# EAGLE design motores_03 (EAGLE 6.1)
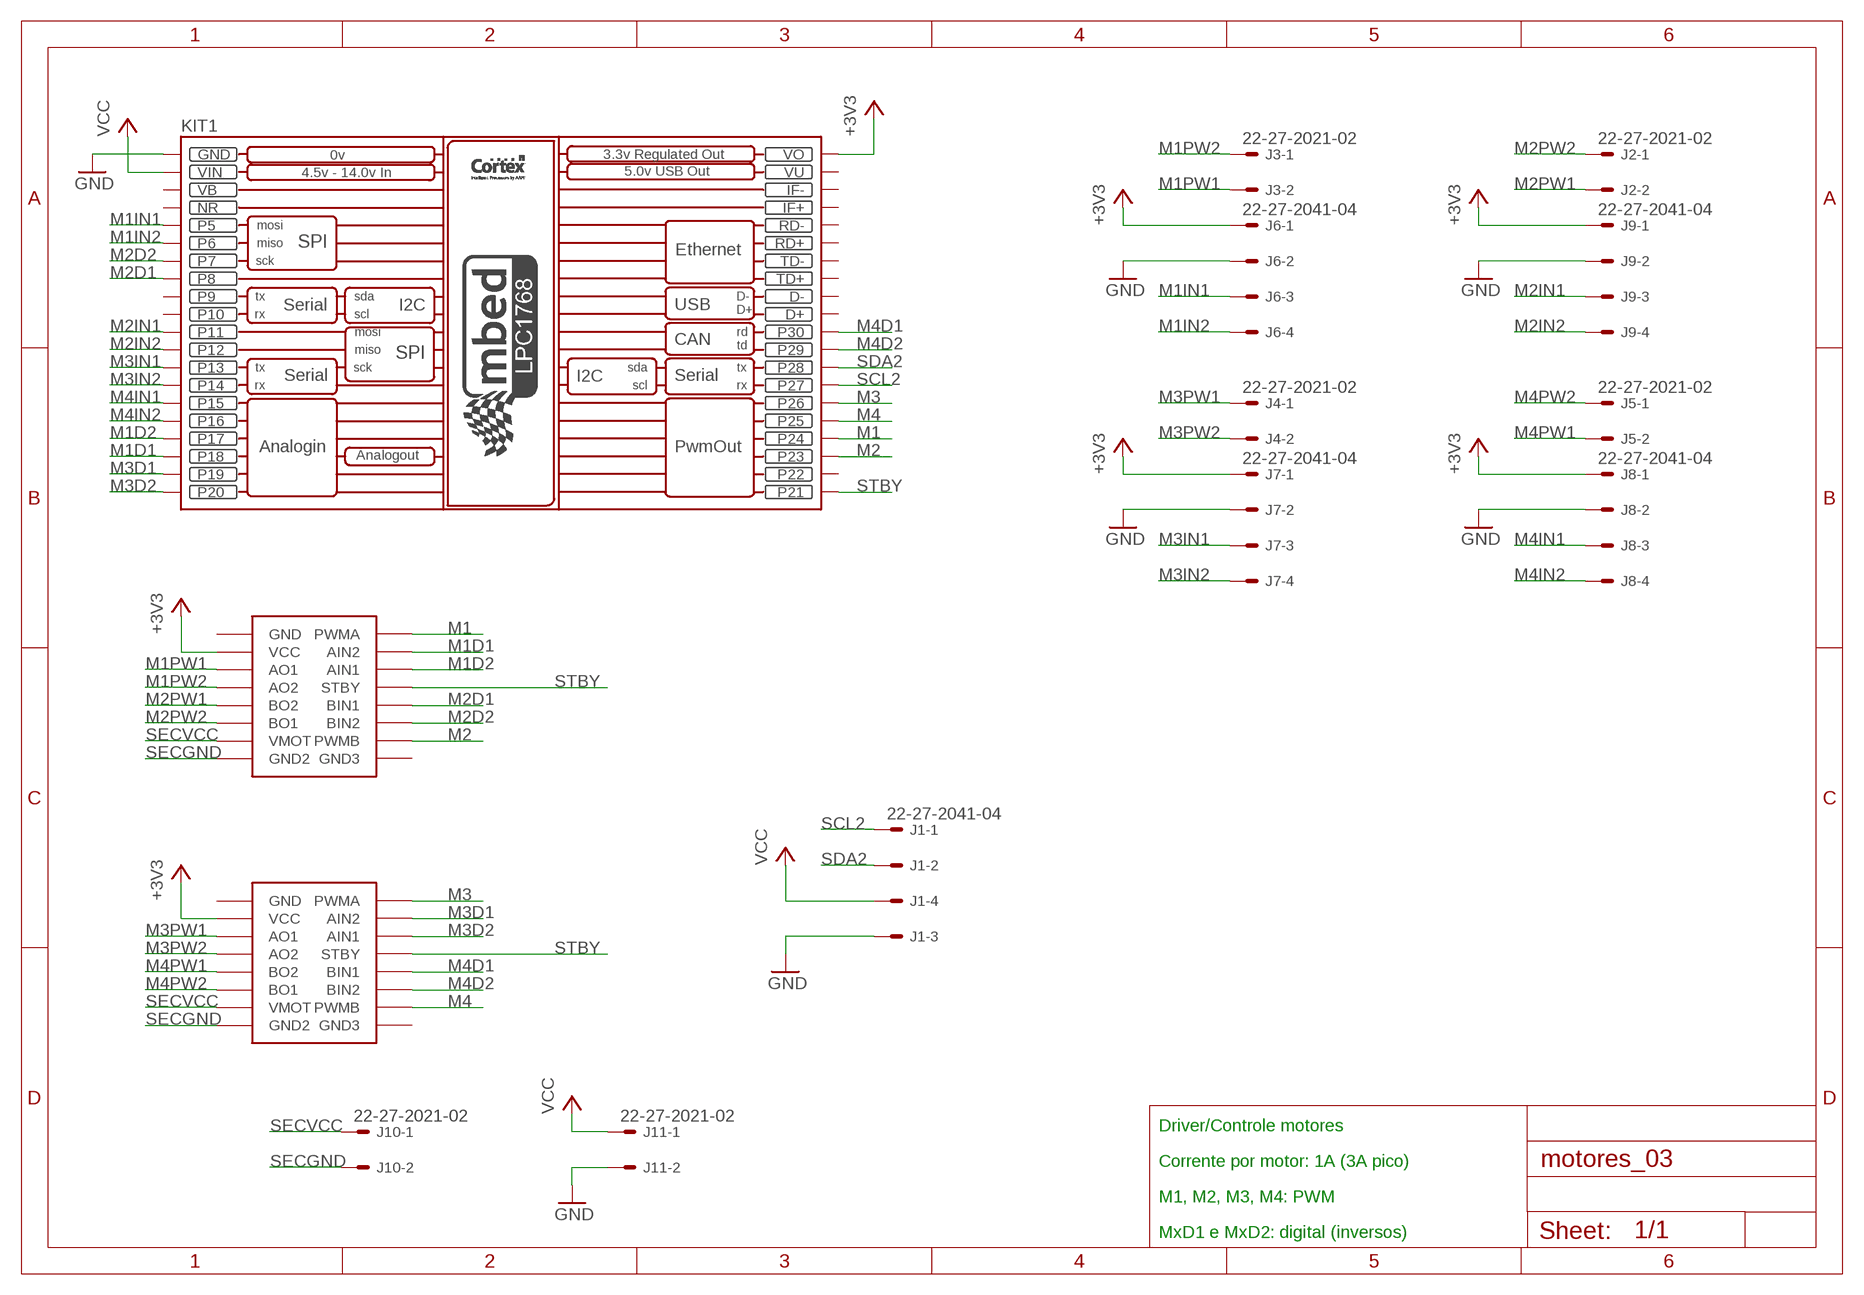
[diagram p0: schematic, sheet 1]

## Parts
J1  22-27-2041-04  [6410-04]
J2  22-27-2021-02  [6410-02]
J3  22-27-2021-02  [6410-02]
J4  22-27-2021-02  [6410-02]
J5  22-27-2021-02  [6410-02]
J6  22-27-2041-04  [6410-04]
J7  22-27-2041-04  [6410-04]
J8  22-27-2041-04  [6410-04]
J9  22-27-2041-04  [6410-04]
J10  22-27-2021-02  [6410-02]
J11  22-27-2021-02  [6410-02]
KIT1  MBED_NXP_LPC1768  [MBED-KIT]
U$1  MOTORDRIVER  [16PH]
U$2  MOTORDRIVER  [16PH]

## Nets
+3V3: J6.1 J7.1 J8.1 J9.1 KIT1.VOUT(VO) U$1.P$2(VCC) U$2.P$2(VCC)
GND: J1.3 J6.2 J7.2 J8.2 J9.2 J11.2 KIT1.GND
M1: KIT1.P$24(P24) U$1.P$16(PWMA)
M1D1: KIT1.P$18(P18) U$1.P$15(AIN2)
M1D2: KIT1.P$17(P17) U$1.P$14(AIN1)
M1IN1: J6.3 KIT1.P$5(P5)
M1IN2: J6.4 KIT1.P$6(P6)
M1PW1: J3.2 U$1.P$3(AO1)
M1PW2: J3.1 U$1.P$4(AO2)
M2: KIT1.P$23(P23) U$1.P$10(PWMB)
M2D1: KIT1.P$8(P8) U$1.P$12(BIN1)
M2D2: KIT1.P$7(P7) U$1.P$11(BIN2)
M2IN1: J9.3 KIT1.P$11(P11)
M2IN2: J9.4 KIT1.P$12(P12)
M2PW1: J2.2 U$1.P$5(BO2)
M2PW2: J2.1 U$1.P$6(BO1)
M3: KIT1.P$26(P26) U$2.P$16(PWMA)
M3D1: KIT1.P$19(P19) U$2.P$15(AIN2)
M3D2: KIT1.P$20(P20) U$2.P$14(AIN1)
M3IN1: J7.3 KIT1.P$13(P13)
M3IN2: J7.4 KIT1.P$14(P14)
M3PW1: J4.1 U$2.P$3(AO1)
M3PW2: J4.2 U$2.P$4(AO2)
M4: KIT1.P$25(P25) U$2.P$10(PWMB)
M4D1: KIT1.P$30(P30) U$2.P$12(BIN1)
M4D2: KIT1.P$29(P29) U$2.P$11(BIN2)
M4IN1: J8.3 KIT1.P$15(P15)
M4IN2: J8.4 KIT1.P$16(P16)
M4PW1: J5.2 U$2.P$5(BO2)
M4PW2: J5.1 U$2.P$6(BO1)
SCL2: J1.1 KIT1.P$27(P27)
SDA2: J1.2 KIT1.P$28(P28)
SECGND: J10.2 U$1.P$8(GND2) U$2.P$8(GND2)
SECVCC: J10.1 U$1.P$7(VMOT) U$2.P$7(VMOT)
STBY: KIT1.P$21(P21) U$1.P$13(STBY) U$2.P$13(STBY)
VCC: J1.4 J11.1 KIT1.VIN
Unconnected: KIT1.D+ KIT1.D- KIT1.IF+ KIT1.IF- KIT1.P$9(P9) KIT1.P$10(P10) KIT1.P$22(P22) KIT1.RD+ KIT1.RD- KIT1.TD+ KIT1.TD- U$1.P$1(GND) U$1.P$9(GND3) U$2.P$1(GND) U$2.P$9(GND3)

## Notes on the sheet
- Driver/Controle motores
- Corrente por motor: 1A (3A pico)
- M1, M2, M3, M4: PWM
- MxD1 e MxD2: digital (inversos)

## Power pins joined to a net without a drawn wire
NR: KIT1.NR
VB: KIT1.VB
VU: KIT1.VU

## Library data of the parts
J1 J6-J9 = con-molex:22-?-04: CONNECTOR wire to board 2.54 mm (.1 inch) pitch header
J2-J5 J10 J11 = con-molex:22-?-02: CONNECTOR wire to board 2.54 mm (.1 inch) pitch header
KIT1 = MBED_v2.1:MBED_NXP_LPC1768: Mbed LPC1768 - ARM CORTEX v2.1 * Schematic symbol is now placed in eagles's default raster. *The pads diameter are suitable for routing between mbed pins * mbed pads are 0.8 mm drill diameter. --------------------------------------------- Created by: Mohamed Yousry *Alexandria, Egypt *Email: mohamed.yousry@ieeegoldegypt.org
U$1 U$2 = Emerotecos:MOTORDRIVER: Pololu Motor Driver 1A 3A pick http://www.pololu.com/catalog/product/713

## Board
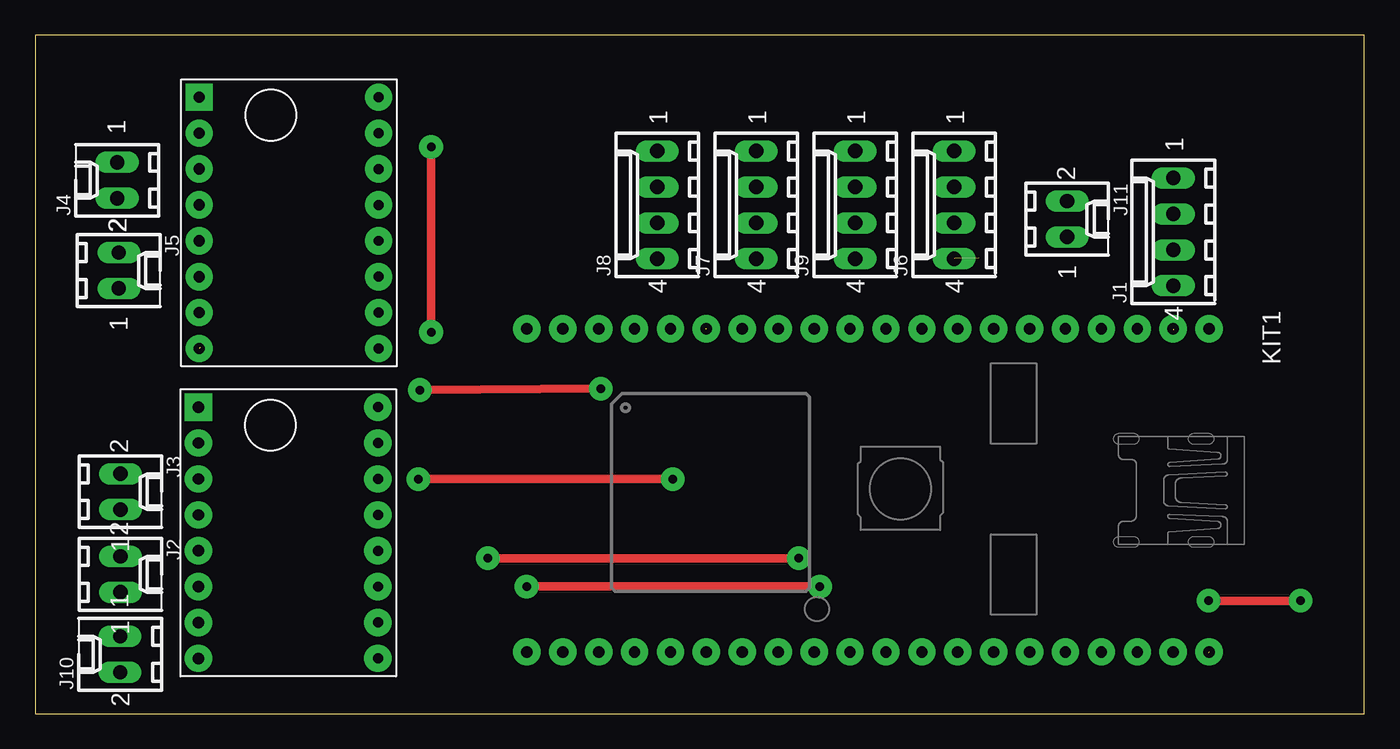
[diagram p1: board, top side]
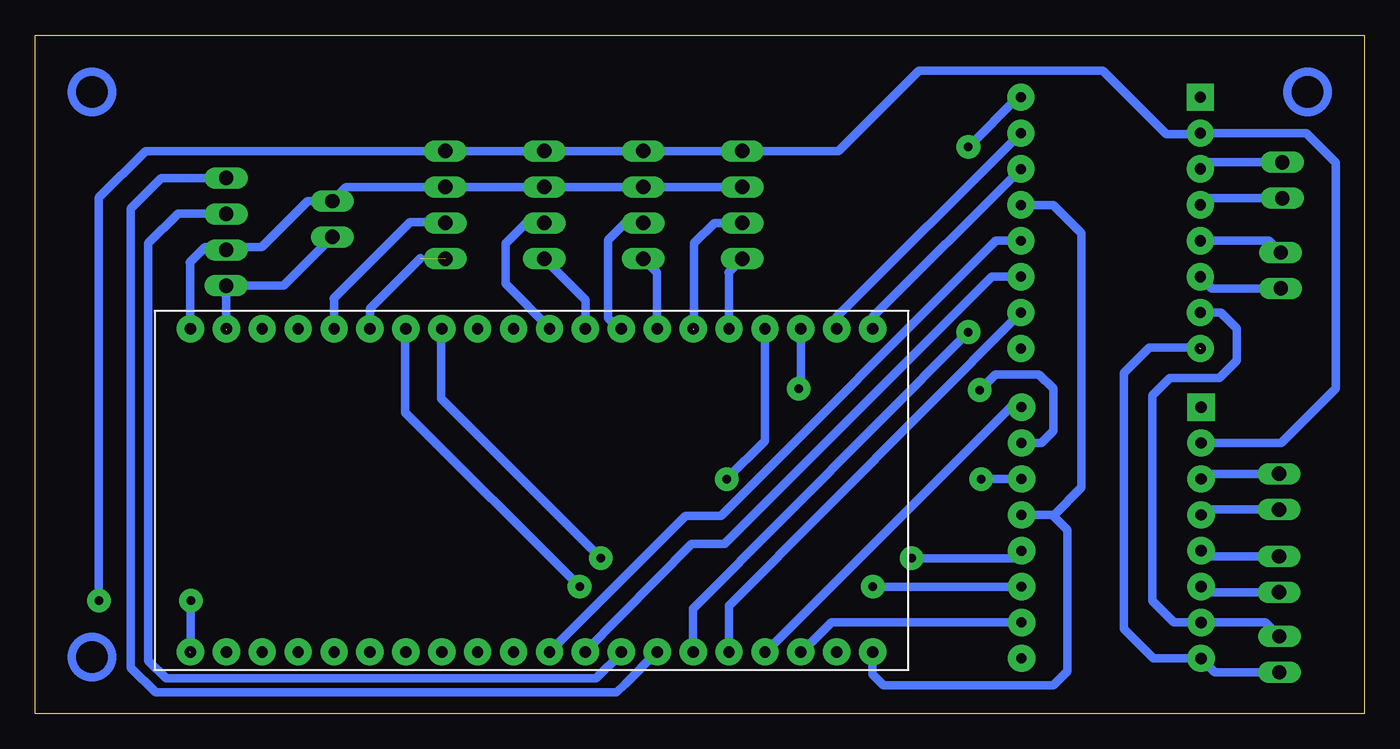
[diagram p2: board, bottom side, seen from below]

Size 94 x 48 mm. Coordinates in mm from the lower left corner, seen from the top.
Outline: 0,0 94,0 94,48 0,48 0,0
Copper layers (1*16): Top 0.035mm / dielectric 1.5mm / Bottom 0.035mm
Design rules: minimum track width 10mil, minimum drill 24mil, track to track 8mil, track to pad 8mil, pad to pad 8mil, via to via 8mil, smd to smd 8mil, copper to edge 40mil, drill to drill 8mil, minimum pad ring 10mil, minimum via ring 8mil, stop-mask expansion 4mil, vias tented up to drill 0mil, thermal gap 10mil

### Footprints (pad centres in the part's own frame; a part is rotated, then mirrored left to right if it is on the bottom)
6410-04 = drill 1.016 long: 1 3.81,0; 2 1.27,0; 3 -1.27,0; 4 -3.81,0
6410-02 = drill 1.016 long: 1 1.27,0; 2 -1.27,0
MBED-KIT = drill 0.8 pad 1.93: D+ 11.43,1.27; D- 11.43,3.81; GND -11.43,24.13; IF+ 11.43,16.51; IF- 11.43,19.05; NR -11.43,16.51; P$5 -11.43,13.97; P$6 -11.43,11.43; P$7 -11.43,8.89; P$8 -11.43,6.35; P$9 -11.43,3.81; P$10 -11.43,1.27; P$11 -11.43,-1.27; P$12 -11.43,-3.81; P$13 -11.43,-6.35; P$14 -11.43,-8.89; P$15 -11.43,-11.43; P$16 -11.43,-13.97; P$17 -11.43,-16.51; P$18 -11.43,-19.05; P$19 -11.43,-21.59; P$20 -11.43,-24.13; P$21 11.43,-24.13; P$22 11.43,-21.59; P$23 11.43,-19.05; P$24 11.43,-16.51; P$25 11.43,-13.97; P$26 11.43,-11.43; P$27 11.43,-8.89; P$28 11.43,-6.35; P$29 11.43,-3.81; P$30 11.43,-1.27; RD+ 11.43,11.43; RD- 11.43,13.97; TD+ 11.43,6.35; TD- 11.43,8.89; VB -11.43,19.05; VIN -11.43,21.59; VOUT 11.43,24.13; VU 11.43,21.59
16PH = drill 0.8 pad 1.93 square: P$1 0,0 | drill 0.8 pad 1.93: P$2 2.54,0; P$3 5.08,0; P$4 7.62,0; P$5 10.16,0; P$6 12.7,0; P$7 15.24,0; P$8 17.78,0 | drill 0.7 pad 1.93: P$9 17.78,12.7; P$10 15.24,12.7; P$11 12.7,12.7; P$12 10.16,12.7; P$13 7.62,12.7; P$14 5.08,12.7; P$15 2.54,12.7; P$16 0,12.7

### Placement (x,y rotation side)
J1  80.5,34.09 90 top
J2  6.01,9.86 270 top
J3  6.01,15.71 270 top
J4  5.79,37.74 90 top
J5  5.9,31.36 270 top
J6  65,36 90 top
J7  51,36 90 top
J8  44,36 90 top
J9  58,36 90 top
J10  6,4.2 90 top
J11  73,35 270 top
KIT1  58.9,15.8 270 top
U$1  11.54,21.69 270 top
U$2  11.59,43.62 270 top

### Tracks (layer width: path | path; a pad name or v marks a point on that pad's centre or on a via)
+3V3  (via drill 0.6 pad 1.68)  (1 unrouted)
  Top 0.61: v89.5,8 v83,8
  Bottom 0.61: v89.5,8 89.5,36.5 86.19,39.81 J6.1 J9.1 J7.1 J8.1 37.19,39.81 31.5,45.5 18.5,45.5 14,41 11.67,41 U$2.P$2 4.08,41.08 2,39 2,23 5.85,19.15 U$1.P$2 | v83,8 83,4.31
GND
  Bottom 0.61: J8.2 J7.2 J9.2 J6.2 72,37.27 J11.2 74.73,36.27 78,33 80.32,33 J1.3 80.68,33 82,33 83.07,31.93 83.03,31.89 KIT1.GND
M1
  Bottom 0.61: U$1.P$16 24.98,21.69 42.3,4.37 KIT1.P$24
M1D1  (via drill 0.6 pad 1.68)
  Top 0.61: v27.2,22.9 v40,23
  Bottom 0.61: U$1.P$15 22.85,19.15 22,20 22,23 23,24 26.1,24 v27.2,22.9 | KIT1.P$18 39.85,23.15 v40,23
M1D2  (via drill 0.6 pad 1.68)
  Top 0.61: v27.1,16.6 v45.1,16.6
  Bottom 0.61: U$1.P$14 v27.09,16.61 v27.1,16.6 | v45.1,16.6 42.39,19.31 KIT1.P$17
M1IN1
  Bottom 0.61: J6.3 65.07,34.8 67.5,34.8 72.91,29.39 72.87,29.35 KIT1.P$5
M1IN2  (1 unrouted)
  Bottom 0.61: KIT1.P$6 70.33,28.67 66.75,32.25
M1PW1
  Bottom 0.61: J3.2 11.17,16.98 U$1.P$3
M1PW2
  Bottom 0.61: J3.1 11.17,14.44 U$1.P$4
M2
  Bottom 0.61: U$1.P$10 37.68,6.45 39.76,4.37 KIT1.P$23
M2D1  (via drill 0.6 pad 1.68)
  Top 0.61: v32,11 v54,11
  Bottom 0.61: U$1.P$12 24.77,11 v32,11 | v54,11 65.29,22.29 65.29,27.19 KIT1.P$8
M2D2  (via drill 0.6 pad 1.68)
  Top 0.61: v34.75,9 v55.5,9
  Bottom 0.61: U$1.P$11 34.24,8.99 v34.75,9 | v55.5,9 67.83,21.33 67.83,27.19 KIT1.P$7
M2IN1
  Bottom 0.61: J9.3 59.27,34.73 60.75,33.25 60.75,30.43 57.55,27.23 KIT1.P$11
M2IN2
  Bottom 0.61: J9.4 55.09,29.28 KIT1.P$12
M2PW1
  Bottom 0.61: J2.2 11.14,11.13 U$1.P$5
M2PW2
  Bottom 0.61: J2.1 11.14,8.59 U$1.P$6
M3  (via drill 0.6 pad 1.68)
  Top 0.61: v28,27 v28,40.1
  Bottom 0.61: v28,27 47.41,7.49 47.47,7.45 KIT1.P$26 | U$2.P$16 24.48,43.62 v28,40.1
M3D1
  Bottom 0.61: U$2.P$15 37.35,28.02 37.35,27.23 KIT1.P$19
M3D2
  Bottom 0.61: KIT1.P$20 34.77,28.06 U$2.P$14
M3IN1
  Bottom 0.61: J7.3 52.27,34.73 53.5,33.5 53.5,28.01 52.72,27.23 KIT1.P$13
M3IN2
  Bottom 0.61: J7.4 50.01,31.2 KIT1.P$14
M3PW1
  Bottom 0.61: J4.1 11.12,39.01 U$2.P$3
M3PW2
  Bottom 0.61: J4.2 11.12,36.47 U$2.P$4
M4
  Bottom 0.61: U$2.P$10 44.87,7.7 44.93,7.66 KIT1.P$25
M4D1
  Bottom 0.61: U$2.P$12 26.04,33.46 45.5,14 48,14 KIT1.P$30
M4D2
  Bottom 0.61: U$2.P$11 26.33,30.92 45.25,12 47.57,12 KIT1.P$29
M4IN1  (1 unrouted)
  Bottom 0.61: J8.3 45.97,34.73 47.4,33.3 47.4,27.21
M4IN2
  Bottom 0.61: J8.4 44.97,31.22 44.93,31.18 KIT1.P$16
M4PW1
  Bottom 0.61: J5.2 6.73,33.46 U$2.P$5
M4PW2
  Bottom 0.61: J5.1 10.76,30.09 U$2.P$6
SCL2
  Bottom 0.61: J1.1 85.1,37.9 87.25,35.75 87.25,3.25 85.5,1.5 52.89,1.5 52.29,2.09 KIT1.P$27
SDA2
  Bottom 0.61: J1.2 80.54,35.4 83.9,35.4 86,33.3 86,3.75 84.75,2.5 54.33,2.5 52.55,4.28 KIT1.P$28
SECGND  (1 unrouted)
  Bottom 0.61: 11.65,25.9 15.2,25.9 17,24.1 17,6 14.91,3.91 U$1.P$8 10.56,2.93 J10.2
SECVCC
  Bottom 0.61: J10.1 6.98,6.45 U$1.P$7 13.45,6.45 15,8 15,22.5 13.75,23.75 10.25,23.75 9,25 9,27.25 10.13,28.38 U$2.P$7
STBY
  Bottom 0.61: 22.07,14.07 21.93,14.07 20,16 20,34 22,36 U$2.P$13 | U$1.P$13 22.07,14.07 | 22.07,14.07 21,13 21,3 22,2 34,2 34.77,2.77 KIT1.P$21
VCC  (1 unrouted)
  Bottom 0.61: J11.1 76.45,30.28 J1.4 80.5,27.13
(copper drawn outside any net)
  shapes: Bottom circle x3